# Altium schematic sheet [04] - RAM.SchDoc
size A3
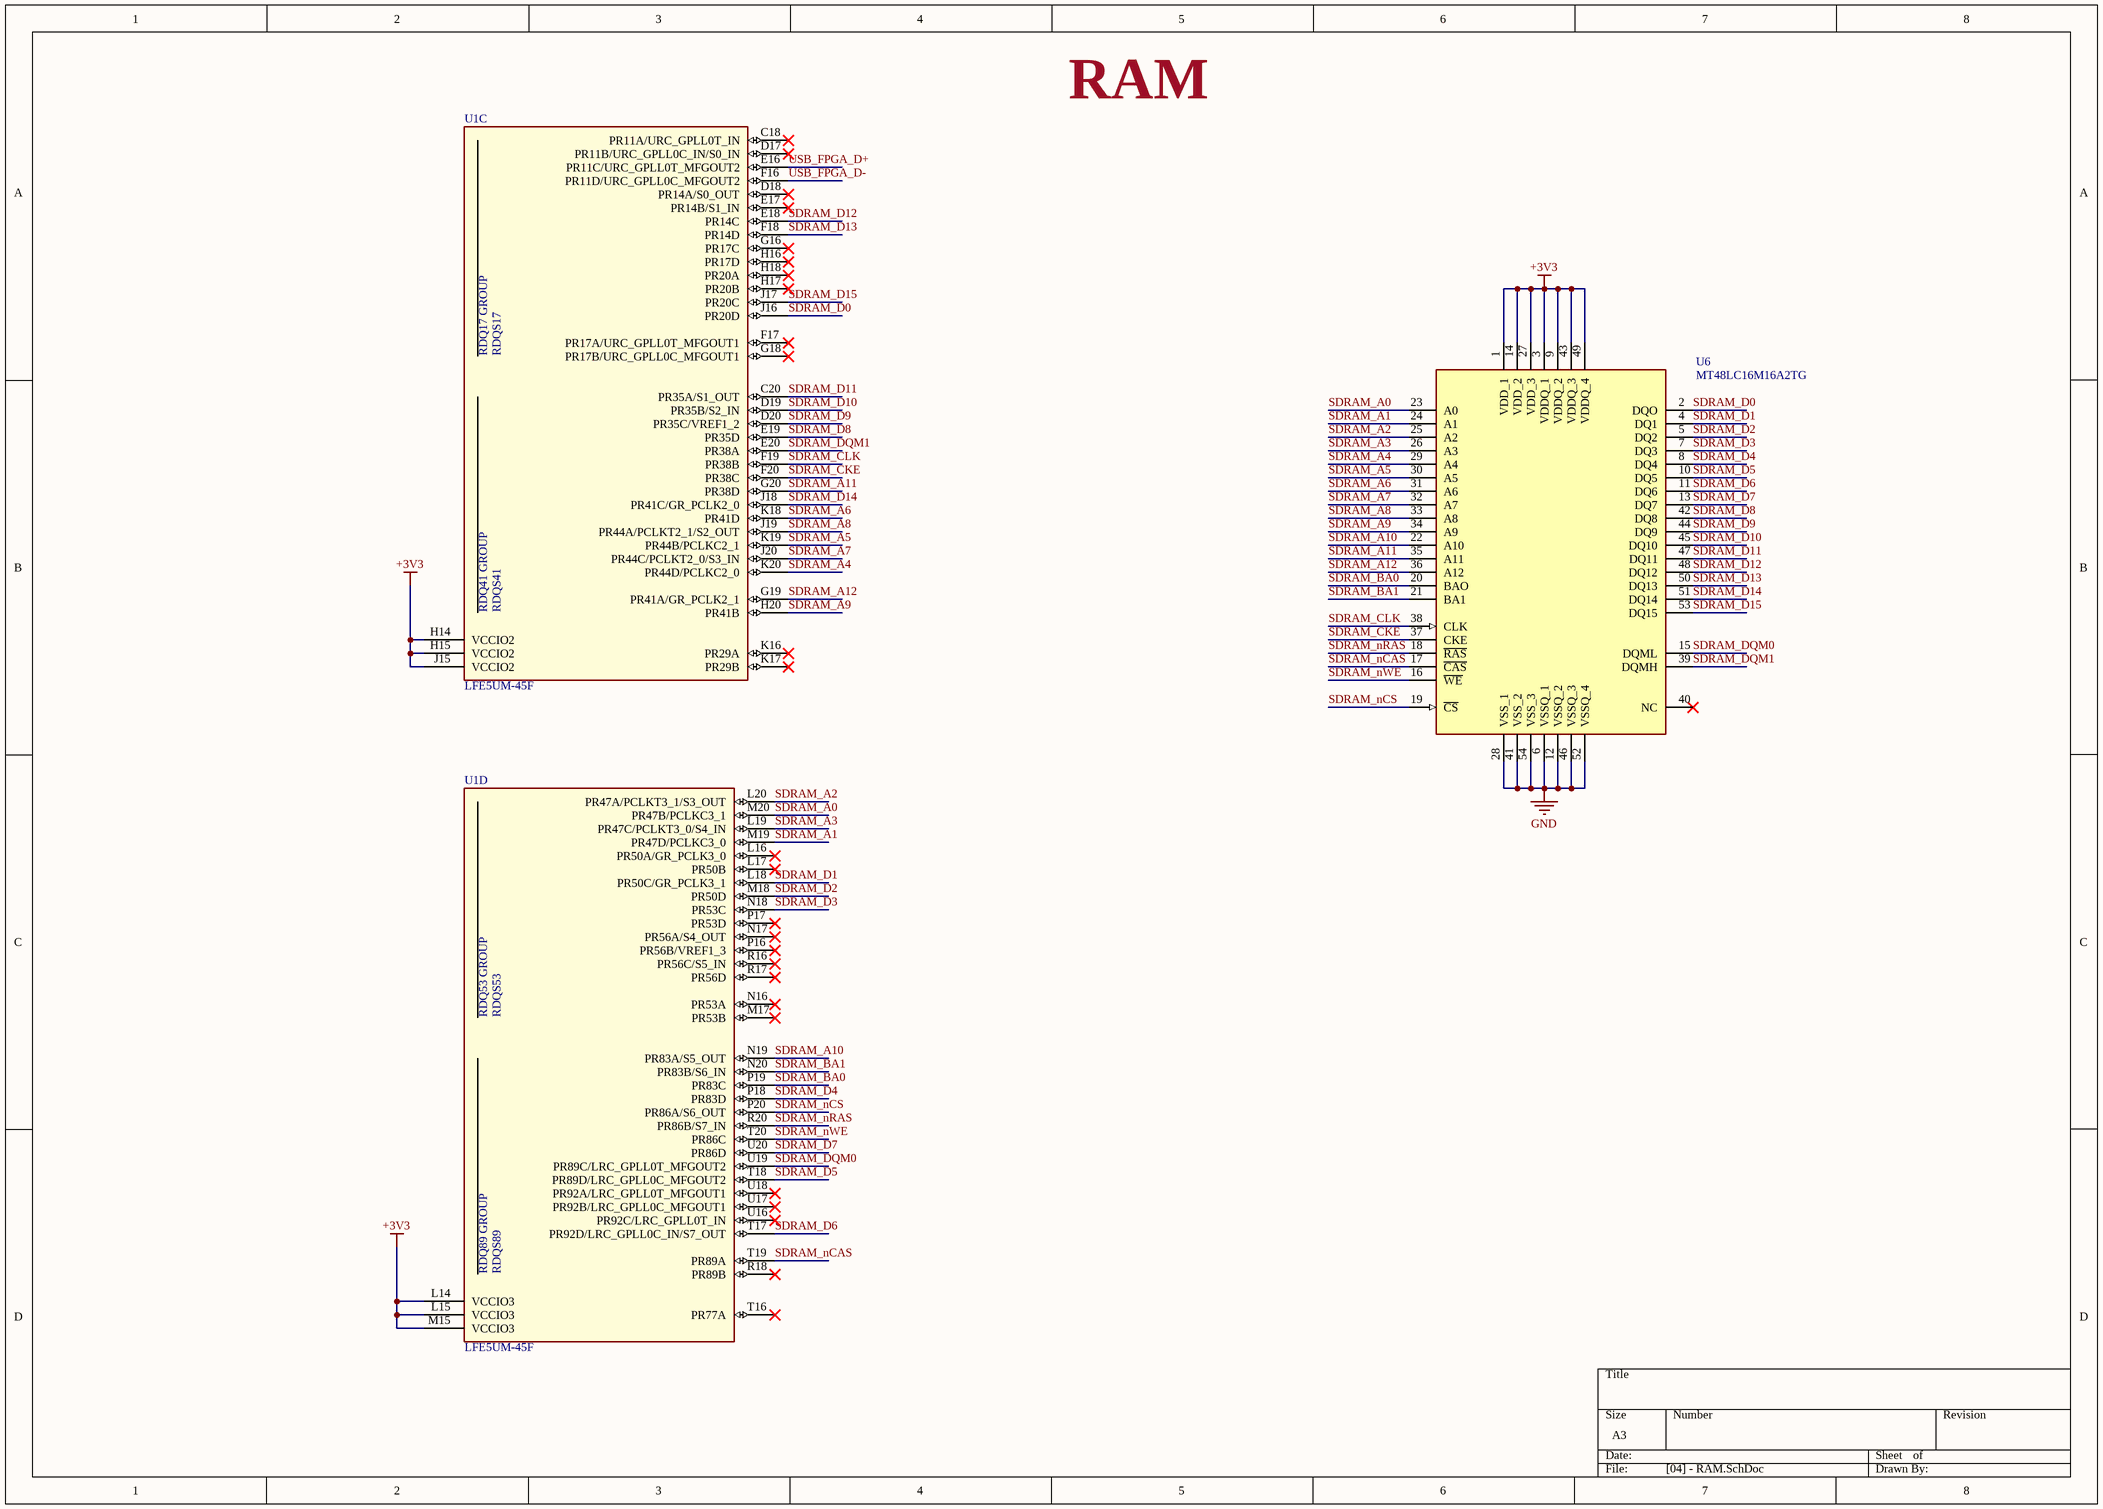
[diagram p0: [04] - RAM.SchDoc]

## Parts
U1  LFE5UM-45F  [LFE5BG381]  (parts C,D of 11)
U6  MT48LC16M16A2TG  [SOP80P1176X120-54N]

## Nets
+3V3: U1.H14(VCCIO2) U1.H15(VCCIO2) U1.J15(VCCIO2) U1.L14(VCCIO3) U1.L15(VCCIO3) U1.M15(VCCIO3) U6.1(VDD_1) U6.3(VDDQ_1) U6.9(VDDQ_2) U6.14(VDD_2) U6.27(VDD_3) U6.43(VDDQ_3) U6.49(VDDQ_4)
GND: U6.6(VSSQ_1) U6.12(VSSQ_2) U6.28(VSS_1) U6.41(VSS_2) U6.46(VSSQ_3) U6.52(VSSQ_4) U6.54(VSS_3)
SDRAM_A0: U1.M20(PR47B/PCLKC3_1) U6.23(A0)
SDRAM_A1: U1.M19(PR47D/PCLKC3_0) U6.24(A1)
SDRAM_A2: U1.L20(PR47A/PCLKT3_1/S3_OUT) U6.25(A2)
SDRAM_A3: U1.L19(PR47C/PCLKT3_0/S4_IN) U6.26(A3)
SDRAM_A4: U1.K20(PR44D/PCLKC2_0) U6.29(A4)
SDRAM_A5: U1.K19(PR44B/PCLKC2_1) U6.30(A5)
SDRAM_A6: U1.K18(PR41D) U6.31(A6)
SDRAM_A7: U1.J20(PR44C/PCLKT2_0/S3_IN) U6.32(A7)
SDRAM_A8: U1.J19(PR44A/PCLKT2_1/S2_OUT) U6.33(A8)
SDRAM_A9: U1.H20(PR41B) U6.34(A9)
SDRAM_A10: U1.N19(PR83A/S5_OUT) U6.22(A10)
SDRAM_A11: U1.G20(PR38D) U6.35(A11)
SDRAM_A12: U1.G19(PR41A/GR_PCLK2_1) U6.36(A12)
SDRAM_BA0: U1.P19(PR83C) U6.20(BAO)
SDRAM_BA1: U1.N20(PR83B/S6_IN) U6.21(BA1)
SDRAM_CKE: U1.F20(PR38C) U6.37(CKE)
SDRAM_CLK: U1.F19(PR38B) U6.38(CLK)
SDRAM_D0: U1.J16(PR20D) U6.2(DQO)
SDRAM_D1: U1.L18(PR50C/GR_PCLK3_1) U6.4(DQ1)
SDRAM_D2: U1.M18(PR50D) U6.5(DQ2)
SDRAM_D3: U1.N18(PR53C) U6.7(DQ3)
SDRAM_D4: U1.P18(PR83D) U6.8(DQ4)
SDRAM_D5: U1.T18(PR89D/LRC_GPLL0C_MFGOUT2) U6.10(DQ5)
SDRAM_D6: U1.T17(PR92D/LRC_GPLL0C_IN/S7_OUT) U6.11(DQ6)
SDRAM_D7: U1.U20(PR86D) U6.13(DQ7)
SDRAM_D8: U1.E19(PR35D) U6.42(DQ8)
SDRAM_D9: U1.D20(PR35C/VREF1_2) U6.44(DQ9)
SDRAM_D10: U1.D19(PR35B/S2_IN) U6.45(DQ10)
SDRAM_D11: U1.C20(PR35A/S1_OUT) U6.47(DQ11)
SDRAM_D12: U1.E18(PR14C) U6.48(DQ12)
SDRAM_D13: U1.F18(PR14D) U6.50(DQ13)
SDRAM_D14: U1.J18(PR41C/GR_PCLK2_0) U6.51(DQ14)
SDRAM_D15: U1.J17(PR20C) U6.53(DQ15)
SDRAM_DQM0: U1.U19(PR89C/LRC_GPLL0T_MFGOUT2) U6.15(DQML)
SDRAM_DQM1: U1.E20(PR38A) U6.39(DQMH)
SDRAM_nCAS: U1.T19(PR89A) U6.17(~{CAS})
SDRAM_nCS: U1.P20(PR86A/S6_OUT) U6.19(~{CS})
SDRAM_nRAS: U1.R20(PR86B/S7_IN) U6.18(~{RAS})
SDRAM_nWE: U1.T20(PR86C) U6.16(~{WE})
USB_FPGA_D+: U1.E16(PR11C/URC_GPLL0T_MFGOUT2)
USB_FPGA_D-: U1.F16(PR11D/URC_GPLL0C_MFGOUT2)

Not connected (* = marked no-connect by the designer): U1 C18(PR11A/URC_GPLL0T_IN)* D17(PR11B/URC_GPLL0C_IN/S0_IN)* D18(PR14A/S0_OUT)* E17(PR14B/S1_IN)* F17(PR17A/URC_GPLL0T_MFGOUT1)* G16(PR17C)* G18(PR17B/URC_GPLL0C_MFGOUT1)* H16(PR17D)* H17(PR20B)* H18(PR20A)* K16(PR29A)* K17(PR29B)* L16(PR50A/GR_PCLK3_0)* L17(PR50B)* M17(PR53B)* N16(PR53A)* N17(PR56A/S4_OUT)* P16(PR56B/VREF1_3)* P17(PR53D)* R16(PR56C/S5_IN)* R17(PR56D)* R18(PR89B)* T16(PR77A)* U16(PR92C/LRC_GPLL0T_IN)* U17(PR92B/LRC_GPLL0C_MFGOUT1)* U18(PR92A/LRC_GPLL0T_MFGOUT1)*; U6 40(NC)*

## Notes on the sheet
- RAM
- (in symbol LFE5UM-45F-6BG381C, part C) RDQ17 GROUP; RDQS17; RDQ41 GROUP; RDQS41
- (in symbol LFE5UM-45F-6BG381C, part D) RDQ53 GROUP; RDQS53; RDQ89 GROUP; RDQS89

## Library data of the parts
U1 = LFE5UM-45F-6BG381C: ECP5 Series 44 K LUTs 203 I/O 1.1 V Slow Surface Mount FPGA - CABGA-381; Manufacturer: Lattice Semiconductor; Number of Logic Blocks (LABs): 11000; Number of Logic Elements/Cells: 44000; RAM Size: 1990656b; Number of I/Os: 203; Supplier 1: Digi-Key; Manufacturer Part Number: LFE5UM-45F-6BG381C; Stock 1: 0; Pricing 1: 90=19.13967 (USD); Mount: Surface Mount; Case/Package: FBGA; Min Operating Temperature: 0°C; Max Operating Temperature: 85°C; Lead Free: Lead Free; ComponentLink1URL: http://www.latticesemi.com/~/media/LatticeSemi/Documents/DataSheets/ECP5/DS1044.pdf?src-supplier=Digi-Key; ComponentLink1Description: http://www.latticesemi.com/~/media/LatticeSemi/Documents/DataSheets/ECP5/DS1044.pdf?src-supplier=Digi-Key; Supplier Part Number 1: 220-1994-ND
U6 = MT48LC16M16A2TG-6A:GTR: IC Dram 256M Parallel 54TSOP; Manufacturer: Alliance Memory; Access Time: 5.4ns; Frequency: 167MHz; Memory Type: Volatile; Memory Size: 256Mb; Supplier 1: Digi-Key; Manufacturer Part Number: MT48LC16M16A2TG-6A:GTR; Stock 1: 0; Mount: Surface Mount; Case/Package: TSOP; Number of Pins: 54; Min Operating Temperature: 0°C; Max Operating Temperature: 70°C; Packaging: Cut Tape; Supplier Part Number 1: 1450-1352-6-ND